# Altium schematic sheet LiPo_Charger.SchDoc: AusBubble : Power : LiPo Charger
size A4; DrawnBy: WR, ND; DocumentNumber: 4; Revision: A; SheetNumber: 4; SheetTotal: 4
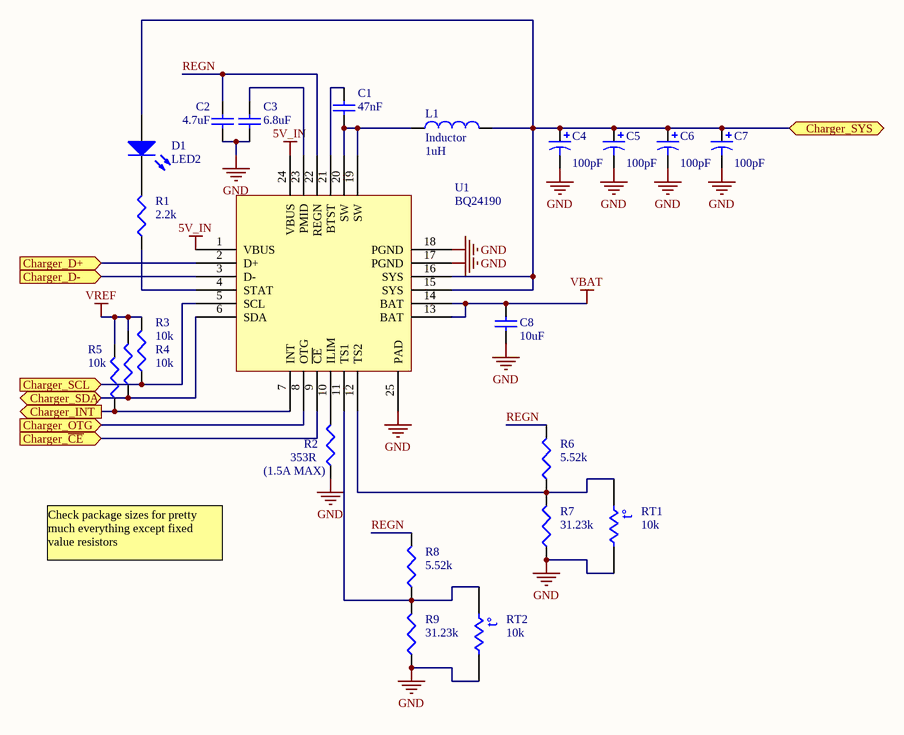
[diagram p0: LiPo_Charger.SchDoc]

## Parts
C1  value 47nF  [1608[0603]]  (hidden comment: Cap Semi)
C2  value 4.7uF  [1608[0603]]  (hidden comment: Cap Semi)
C3  value 6.8uF  [1608[0603]]  (hidden comment: Cap Semi)
C4  value 100pF  [C0805]  (hidden comment: Cap Pol3)
C5  value 100pF  [C0805]  (hidden comment: Cap Pol3)
C6  value 100pF  [C0805]  (hidden comment: Cap Pol3)
C7  value 100pF  [C0805]  (hidden comment: Cap Pol3)
C8  value 10uF  [1608[0603]]  (hidden comment: Cap Semi)
D1  LED2  [3.2X1.6X1.1]
L1  Inductor  value 1uH  [0603]
R1  value 2.2k  [J1-0603]  (hidden comment: Res3)
R2  (1.5A MAX)  value 353R  [J1-0603]
R3  value 10k  [J1-0603]
R4  value 10k  [J1-0603]
R5  value 10k  [J1-0603]
R6  value 5.52k  [J1-0603]  (hidden comment: Res3)
R7  value 31.23k  [J1-0603]  (hidden comment: Res3)
R8  value 5.52k  [J1-0603]  (hidden comment: Res3)
R9  value 31.23k  [J1-0603]  (hidden comment: Res3)
RT1  value 10k  [6-0805_N]  (hidden comment: Res Thermal)
RT2  value 10k  [6-0805_N]  (hidden comment: Res Thermal)
U1  BQ24190  [QFN50P400X400-24V9L]

## Ports
Charger_D+ (in), Charger_D- (in), Charger_INT (out), Charger_OTG (in), Charger_SCL (in), Charger_SDA (bidir), Charger_SYS, Charger_~{CE} (in)

## Nets
5V_IN: U1.1(VBUS) U1.24(VBUS)
GND: C2.1 C3.1 C4.2 C5.2 C6.2 C7.2 C8.2 R2.1 R7.1 R9.1 RT1.2 RT2.2 U1.17(PGND) U1.18(PGND) U1.25(PAD)
VBAT: C8.1 U1.13(BAT) U1.14(BAT)
VREF: R3.2 R4.2 R5.2
Charger_~{CE}: U1.9(~{CE}) ; port Charger_~{CE}
Charger_D+: U1.2(D+) ; port Charger_D+
Charger_D-: U1.3(D-) ; port Charger_D-
Charger_INT: R5.1 U1.7(INT) ; port Charger_INT
Charger_OTG: U1.8(OTG) ; port Charger_OTG
Charger_SCL: R3.1 U1.5(SCL) ; port Charger_SCL
Charger_SDA: R4.1 U1.6(SDA) ; port Charger_SDA
Charger_SYS: C4.1 C5.1 C6.1 C7.1 D1.1(A) L1.2 U1.15(SYS) U1.16(SYS) ; port Charger_SYS
REGN: C2.2 R6.2 R8.2 U1.22(REGN)
NetC1_1: C1.1 L1.1 U1.19(SW) U1.20(SW)
NetC1_2: C1.2 U1.21(BTST)
NetC3_2: C3.2 U1.23(PMID)
NetD1_2: D1.2(K) R1.2
NetR1_1: R1.1 U1.4(STAT)
NetR2_2: R2.2 U1.10(ILIM)
NetR6_1: R6.1 R7.2 RT1.1 U1.12(TS2)
NetR8_1: R8.1 R9.2 RT2.1 U1.11(TS1)

## Notes on the sheet
- Check package sizes for pretty much everything except fixed value resistors
- (in symbol Res Thermal) t°

## Library data of the parts
C1-C3 C8 = Cap Semi: Capacitor (Semiconductor SIM Model); Published: 8-Jun-2000; LatestRevisionDate: 29-May-2009; LatestRevisionNote: IPC-7351 Footprint Added.; PackageReference: C1206; Publisher: Altium Limited; PackageDescription: Chip Capacitor
C4-C7 = Cap Pol3: Polarized Capacitor (Surface Mount); Published: 8-Jun-2000; LatestRevisionDate: 29-May-2009; LatestRevisionNote: IPC-7351 Footprint Added.; PackageReference: C0805; Publisher: Altium Limited; PackageDescription: Chip Capacitor
D1 = LED2: Typical RED, GREEN, YELLOW, AMBER GaAs LED; Published: 8-Jun-2000; LatestRevisionDate: 17-Jul-2002; LatestRevisionNote: Re-released for DXP Platform.; PackageVersion: Feb-2002; PackageReference: 3.2X1.6X1.1; Publisher: Altium Limited; PackageDescription: SM LED; 2 Flat Leads
L1 = Inductor: Code_IEC: 1005; Published: 8-Jun-2000; LatestRevisionDate: 29-May-2009; LatestRevisionNote: IPC-7351 Footprint Added.; PackageReference: 0402-A; Publisher: Altium Limited; PackageDescription: Chip Inductor; Code_JEITA: 0402
R1-R9 = Res3: Resistor; Published: 8-Jun-2000; LatestRevisionDate: 29-May-2009; LatestRevisionNote: IPC-7351 Footprint Added.; PackageReference: J1-0603; Publisher: Altium Limited; PackageDescription: Chip Resistor
RT1 RT2 = Res Thermal: Thermistor; Published: 24-Mar-1999; LatestRevisionDate: 29-May-2009; LatestRevisionNote: IPC-7351 Footprint Added.; PackageVersion: Mar-2003; PackageReference: 6-0805; Publisher: Altium Limited; PackageDescription: Chip Resistor 0805 Case Size; Code_IPC: RESC2012
U1 = BQ24190: I2C Controlled 4.5A Single Cell LiPo Charger w/ USB